# EAGLE schematic Layer1 (EAGLE 9.6.1)

## Sheet 1 of 5
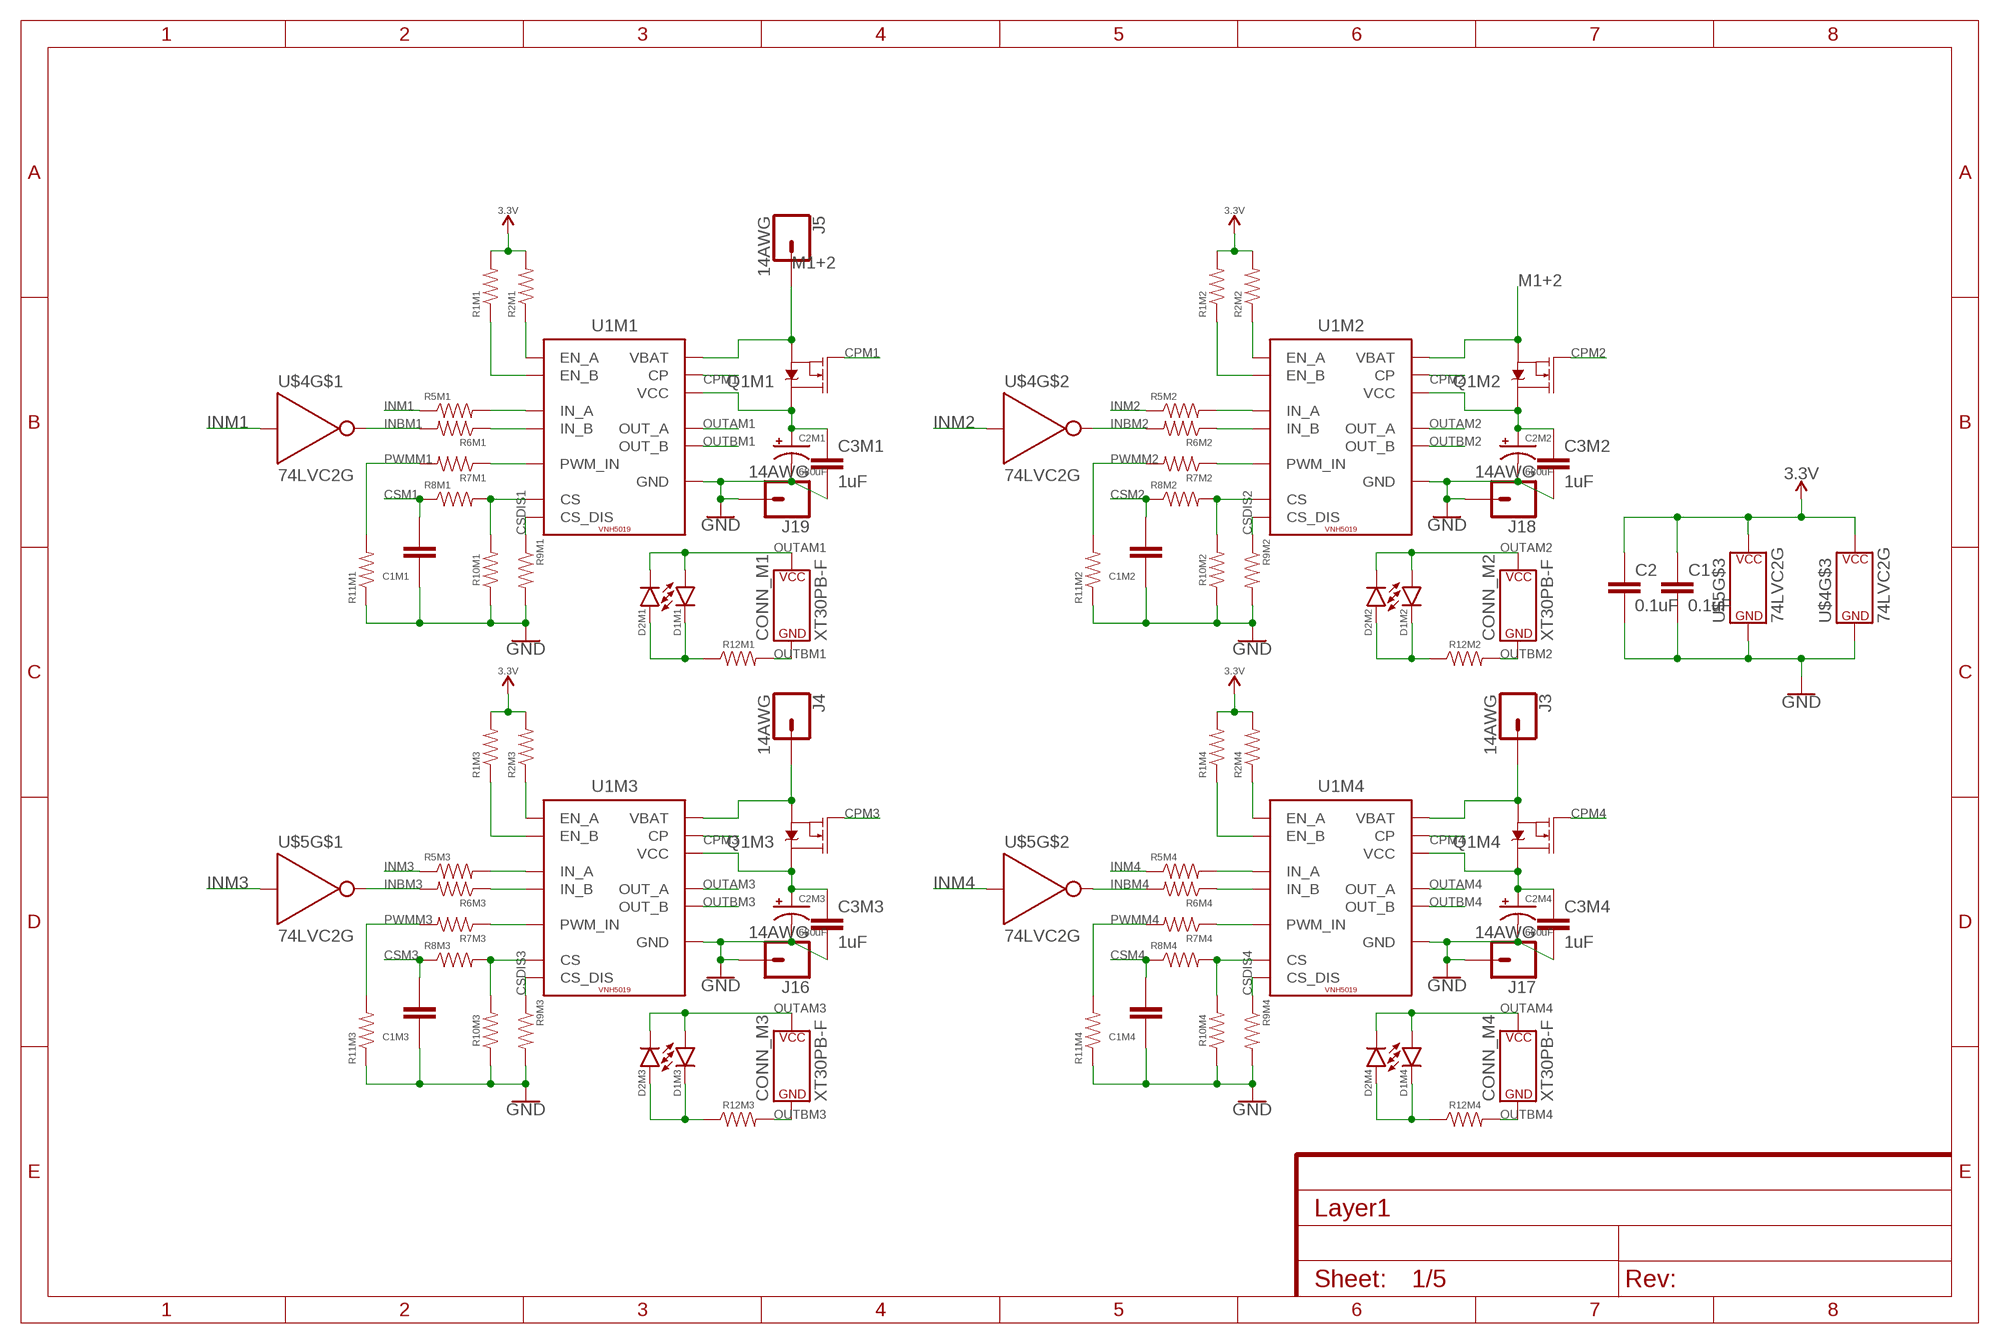
[diagram p0: schematic, sheet 1]

### Parts
C1  0.1uF  CAPACITOR0603  [C0603]
C1M1  33nF  CAPACITOR0603  [C0603]
C1M2  33nF  CAPACITOR0603  [C0603]
C1M3  33nF  CAPACITOR0603  [C0603]
C1M4  33nF  CAPACITOR0603  [C0603]
C2  0.1uF  CAPACITOR0603  [C0603]
C2M1  680uF  CPOL-USE3.5-8  [E3,5-8]
C2M2  680uF  CPOL-USE3.5-8  [E3,5-8]
C2M3  680uF  CPOL-USE3.5-8  [E3,5-8]
C2M4  680uF  CPOL-USE3.5-8  [E3,5-8]
C3M1  1uF  CAPACITOR0603  [C0603]
C3M2  1uF  CAPACITOR0603  [C0603]
C3M3  1uF  CAPACITOR0603  [C0603]
C3M4  1uF  CAPACITOR0603  [C0603]
CONN_M1  XT30PB-F  [XT30PB-F]
CONN_M2  XT30PB-F  [XT30PB-F]
CONN_M3  XT30PB-F  [XT30PB-F]
CONN_M4  XT30PB-F  [XT30PB-F]
D1M1  GREEN  LED0603  [LED-0603]
D1M2  GREEN  LED0603  [LED-0603]
D1M3  GREEN  LED0603  [LED-0603]
D1M4  GREEN  LED0603  [LED-0603]
D2M1  RED  LED0603  [LED-0603]
D2M2  RED  LED0603  [LED-0603]
D2M3  RED  LED0603  [LED-0603]
D2M4  RED  LED0603  [LED-0603]
J3  14AWG  [14AWG]
J4  14AWG  [14AWG]
J5  14AWG  [14AWG]
J16  14AWG  [14AWG]
J17  14AWG  [14AWG]
J18  14AWG  [14AWG]
J19  14AWG  [14AWG]
Q1M1  AOD482  MOSFET-NCH-DPAK  [DPAK]
Q1M2  AOD482  MOSFET-NCH-DPAK  [DPAK]
Q1M3  AOD482  MOSFET-NCH-DPAK  [DPAK]
Q1M4  AOD482  MOSFET-NCH-DPAK  [DPAK]
R1M1  3.24k  RESISTOR0603  [R0603]
R1M2  3.24k  RESISTOR0603  [R0603]
R1M3  3.24k  RESISTOR0603  [R0603]
R1M4  3.24k  RESISTOR0603  [R0603]
R2M1  3.24k  RESISTOR0603  [R0603]
R2M2  3.24k  RESISTOR0603  [R0603]
R2M3  3.24k  RESISTOR0603  [R0603]
R2M4  3.24k  RESISTOR0603  [R0603]
R5M1  1k  RESISTOR0603  [R0603]
R5M2  1k  RESISTOR0603  [R0603]
R5M3  1k  RESISTOR0603  [R0603]
R5M4  1k  RESISTOR0603  [R0603]
R6M1  1k  RESISTOR0603  [R0603]
R6M2  1k  RESISTOR0603  [R0603]
R6M3  1k  RESISTOR0603  [R0603]
R6M4  1k  RESISTOR0603  [R0603]
R7M1  1k  RESISTOR0603  [R0603]
R7M2  1k  RESISTOR0603  [R0603]
R7M3  1k  RESISTOR0603  [R0603]
R7M4  1k  RESISTOR0603  [R0603]
R8M1  10k  RESISTOR0603  [R0603]
R8M2  10k  RESISTOR0603  [R0603]
R8M3  10k  RESISTOR0603  [R0603]
R8M4  10k  RESISTOR0603  [R0603]
R9M1  10k  RESISTOR0603  [R0603]
R9M2  10k  RESISTOR0603  [R0603]
R9M3  10k  RESISTOR0603  [R0603]
R9M4  10k  RESISTOR0603  [R0603]
R10M1  1k  RESISTOR0603  [R0603]
R10M2  1k  RESISTOR0603  [R0603]
R10M3  1k  RESISTOR0603  [R0603]
R10M4  1k  RESISTOR0603  [R0603]
R11M1  10k  RESISTOR0603  [R0603]
R11M2  10k  RESISTOR0603  [R0603]
R11M3  10k  RESISTOR0603  [R0603]
R11M4  10k  RESISTOR0603  [R0603]
R12M1  4.7k  RESISTOR0603  [R0603]
R12M2  4.7k  RESISTOR0603  [R0603]
R12M3  4.7k  RESISTOR0603  [R0603]
R12M4  4.7k  RESISTOR0603  [R0603]
U1M1  VNH5019  [POWERSO-30]
U1M2  VNH5019  [POWERSO-30]
U1M3  VNH5019  [POWERSO-30]
U1M4  VNH5019  [POWERSO-30]
U$4  74LVC2G  [SOT23-6]
U$5  74LVC2G  [SOT23-6]

### Nets
3.3V: C1.1 C2.1 R1M1.2 R1M2.2 R1M3.2 R1M4.2 R2M1.2 R2M2.2 R2M3.2 R2M4.2 U$4.5(P$V+) U$5.5(P$V+) ; also sheet 3,4
CPM1: Q1M1.1(G) U1M1.P11(CP)
CPM2: Q1M2.1(G) U1M2.P11(CP)
CPM3: Q1M3.1(G) U1M3.P11(CP)
CPM4: Q1M4.1(G) U1M4.P11(CP)
CSDIS1: R9M1.1 U1M1.P6(CS_DIS)
CSDIS2: R9M2.1 U1M2.P6(CS_DIS)
CSDIS3: R9M3.1 U1M3.P6(CS_DIS)
CSDIS4: R9M4.1 U1M4.P6(CS_DIS)
CSM1: C1M1.2 R8M1.1 ; also sheet 2
CSM2: C1M2.2 R8M2.1 ; also sheet 2
CSM3: C1M3.2 R8M3.1 ; also sheet 2
CSM4: C1M4.2 R8M4.1 ; also sheet 2
GND: C1.2 C1M1.1 C1M2.1 C1M3.1 C1M4.1 C2.2 C2M1.- C2M2.- C2M3.- C2M4.- C3M1.2 C3M2.2 C3M3.2 C3M4.2 J16.P$1 J17.P$1 J18.P$1 J19.P$1 R9M1.2 R9M2.2 R9M3.2 R9M4.2 R10M1.1 R10M2.1 R10M3.1 R10M4.1 R11M1.1 R11M2.1 R11M3.1 R11M4.1 U1M1.P18(GND) U1M1.P19(GND) U1M1.P20(GND) U1M1.P26(GND) U1M1.P27(GND) U1M1.P28(GND) U1M2.P18(GND) U1M2.P19(GND) U1M2.P20(GND) U1M2.P26(GND) U1M2.P27(GND) U1M2.P28(GND) U1M3.P18(GND) U1M3.P19(GND) U1M3.P20(GND) U1M3.P26(GND) U1M3.P27(GND) U1M3.P28(GND) U1M4.P18(GND) U1M4.P19(GND) U1M4.P20(GND) U1M4.P26(GND) U1M4.P27(GND) U1M4.P28(GND) U$4.2(P$V-) U$5.2(P$V-) ; also sheet 2,3,4,5
INBM1: R6M1.2 U$4.6(Y)
INBM2: R6M2.2 U$4.4(Y)
INBM3: R6M3.2 U$5.6(Y)
INBM4: R6M4.2 U$5.4(Y)
INM1: R5M1.1 U$4.1(A) ; also sheet 4
INM2: R5M2.1 U$4.3(A) ; also sheet 4
INM3: R5M3.1 U$5.1(A) ; also sheet 4
INM4: R5M4.1 U$5.3(A) ; also sheet 4
M1+2: J5.P$1 Q1M1.3(S) Q1M2.3(S) U1M1.P12(VBAT) U1M2.P12(VBAT)
N$39: J3.P$1 Q1M4.3(S) U1M4.P12(VBAT)
N$40: J4.P$1 Q1M3.3(S) U1M3.P12(VBAT)
N$58: C2M1.+ C3M1.1 Q1M1.4(D) U1M1.P3(VCC) U1M1.P13(VCC) U1M1.P23(VCC) U1M1.P$19(VCC) U1M1.P$20(VCC) U1M1.P$21(VCC) U1M1.P$22(VCC) U1M1.P$23(VCC) U1M1.P$24(VCC) U1M1.P$25(VCC) U1M1.P$26(VCC) U1M1.P$27(VCC) U1M1.P$28(VCC) U1M1.SLUG1(VCC)
N$59: R2M1.1 U1M1.P5(EN_A)
N$60: R5M1.2 U1M1.P4(IN_A)
N$61: R1M1.1 U1M1.P9(EN_B)
N$62: R6M1.1 U1M1.P10(IN_B)
N$63: R8M1.2 R10M1.2 U1M1.P8(CS)
N$64: R7M1.1 U1M1.P7(PWM_IN)
N$65: D1M2.C D2M2.A R12M2.1
N$66: C2M2.+ C3M2.1 Q1M2.4(D) U1M2.P3(VCC) U1M2.P13(VCC) U1M2.P23(VCC) U1M2.P$19(VCC) U1M2.P$20(VCC) U1M2.P$21(VCC) U1M2.P$22(VCC) U1M2.P$23(VCC) U1M2.P$24(VCC) U1M2.P$25(VCC) U1M2.P$26(VCC) U1M2.P$27(VCC) U1M2.P$28(VCC) U1M2.SLUG1(VCC)
N$67: R2M2.1 U1M2.P5(EN_A)
N$68: R5M2.2 U1M2.P4(IN_A)
N$69: R1M2.1 U1M2.P9(EN_B)
N$70: R6M2.1 U1M2.P10(IN_B)
N$71: R8M2.2 R10M2.2 U1M2.P8(CS)
N$72: R7M2.1 U1M2.P7(PWM_IN)
N$73: D1M3.C D2M3.A R12M3.1
N$74: C2M3.+ C3M3.1 Q1M3.4(D) U1M3.P3(VCC) U1M3.P13(VCC) U1M3.P23(VCC) U1M3.P$19(VCC) U1M3.P$20(VCC) U1M3.P$21(VCC) U1M3.P$22(VCC) U1M3.P$23(VCC) U1M3.P$24(VCC) U1M3.P$25(VCC) U1M3.P$26(VCC) U1M3.P$27(VCC) U1M3.P$28(VCC) U1M3.SLUG1(VCC)
N$75: R2M3.1 U1M3.P5(EN_A)
N$76: R5M3.2 U1M3.P4(IN_A)
N$77: R1M3.1 U1M3.P9(EN_B)
N$78: R6M3.1 U1M3.P10(IN_B)
N$79: R8M3.2 R10M3.2 U1M3.P8(CS)
N$80: R7M3.1 U1M3.P7(PWM_IN)
N$81: D1M4.C D2M4.A R12M4.1
N$82: C2M4.+ C3M4.1 Q1M4.4(D) U1M4.P3(VCC) U1M4.P13(VCC) U1M4.P23(VCC) U1M4.P$19(VCC) U1M4.P$20(VCC) U1M4.P$21(VCC) U1M4.P$22(VCC) U1M4.P$23(VCC) U1M4.P$24(VCC) U1M4.P$25(VCC) U1M4.P$26(VCC) U1M4.P$27(VCC) U1M4.P$28(VCC) U1M4.SLUG1(VCC)
N$83: R2M4.1 U1M4.P5(EN_A)
N$84: R5M4.2 U1M4.P4(IN_A)
N$85: R1M4.1 U1M4.P9(EN_B)
N$86: R6M4.1 U1M4.P10(IN_B)
N$87: R8M4.2 R10M4.2 U1M4.P8(CS)
N$88: R7M4.1 U1M4.P7(PWM_IN)
N$104: D1M1.C D2M1.A R12M1.1
OUTAM1: CONN_M1.+(P$V+) D1M1.A D2M1.C U1M1.P1(OUT_A) U1M1.P25(OUT_A) U1M1.P30(OUT_A) U1M1.P$1(OUT_A) U1M1.P$2(OUT_A) U1M1.P$3(OUT_A) U1M1.P$4(OUT_A) U1M1.P$5(OUT_A) U1M1.P$6(OUT_A) U1M1.P$7(OUT_A) U1M1.P$8(OUT_A) U1M1.P$9(OUT_A) U1M1.SLUG2(OUT_A)
OUTAM2: CONN_M2.+(P$V+) D1M2.A D2M2.C U1M2.P1(OUT_A) U1M2.P25(OUT_A) U1M2.P30(OUT_A) U1M2.P$1(OUT_A) U1M2.P$2(OUT_A) U1M2.P$3(OUT_A) U1M2.P$4(OUT_A) U1M2.P$5(OUT_A) U1M2.P$6(OUT_A) U1M2.P$7(OUT_A) U1M2.P$8(OUT_A) U1M2.P$9(OUT_A) U1M2.SLUG2(OUT_A)
OUTAM3: CONN_M3.+(P$V+) D1M3.A D2M3.C U1M3.P1(OUT_A) U1M3.P25(OUT_A) U1M3.P30(OUT_A) U1M3.P$1(OUT_A) U1M3.P$2(OUT_A) U1M3.P$3(OUT_A) U1M3.P$4(OUT_A) U1M3.P$5(OUT_A) U1M3.P$6(OUT_A) U1M3.P$7(OUT_A) U1M3.P$8(OUT_A) U1M3.P$9(OUT_A) U1M3.SLUG2(OUT_A)
OUTAM4: CONN_M4.+(P$V+) D1M4.A D2M4.C U1M4.P1(OUT_A) U1M4.P25(OUT_A) U1M4.P30(OUT_A) U1M4.P$1(OUT_A) U1M4.P$2(OUT_A) U1M4.P$3(OUT_A) U1M4.P$4(OUT_A) U1M4.P$5(OUT_A) U1M4.P$6(OUT_A) U1M4.P$7(OUT_A) U1M4.P$8(OUT_A) U1M4.P$9(OUT_A) U1M4.SLUG2(OUT_A)
OUTBM1: CONN_M1.-(P$V-) R12M1.2 U1M1.P15(OUT_B) U1M1.P16(OUT_B) U1M1.P21(OUT_B) U1M1.P$10(OUT_B) U1M1.P$11(OUT_B) U1M1.P$12(OUT_B) U1M1.P$13(OUT_B) U1M1.P$14(OUT_B) U1M1.P$15(OUT_B) U1M1.P$16(OUT_B) U1M1.P$17(OUT_B) U1M1.P$18(OUT_B) U1M1.SLUG3(OUT_B)
OUTBM2: CONN_M2.-(P$V-) R12M2.2 U1M2.P15(OUT_B) U1M2.P16(OUT_B) U1M2.P21(OUT_B) U1M2.P$10(OUT_B) U1M2.P$11(OUT_B) U1M2.P$12(OUT_B) U1M2.P$13(OUT_B) U1M2.P$14(OUT_B) U1M2.P$15(OUT_B) U1M2.P$16(OUT_B) U1M2.P$17(OUT_B) U1M2.P$18(OUT_B) U1M2.SLUG3(OUT_B)
OUTBM3: CONN_M3.-(P$V-) R12M3.2 U1M3.P15(OUT_B) U1M3.P16(OUT_B) U1M3.P21(OUT_B) U1M3.P$10(OUT_B) U1M3.P$11(OUT_B) U1M3.P$12(OUT_B) U1M3.P$13(OUT_B) U1M3.P$14(OUT_B) U1M3.P$15(OUT_B) U1M3.P$16(OUT_B) U1M3.P$17(OUT_B) U1M3.P$18(OUT_B) U1M3.SLUG3(OUT_B)
OUTBM4: CONN_M4.-(P$V-) R12M4.2 U1M4.P15(OUT_B) U1M4.P16(OUT_B) U1M4.P21(OUT_B) U1M4.P$10(OUT_B) U1M4.P$11(OUT_B) U1M4.P$12(OUT_B) U1M4.P$13(OUT_B) U1M4.P$14(OUT_B) U1M4.P$15(OUT_B) U1M4.P$16(OUT_B) U1M4.P$17(OUT_B) U1M4.P$18(OUT_B) U1M4.SLUG3(OUT_B)
PWMM1: R7M1.2 R11M1.2 ; also sheet 4
PWMM2: R7M2.2 R11M2.2 ; also sheet 4
PWMM3: R7M3.2 R11M3.2 ; also sheet 4
PWMM4: R7M4.2 R11M4.2 ; also sheet 4
Unconnected: U1M1.P2(NC) U1M1.P14(NC) U1M1.P17(NC) U1M1.P22(NC) U1M1.P24(NC) U1M1.P29(NC) U1M2.P2(NC) U1M2.P14(NC) U1M2.P17(NC) U1M2.P22(NC) U1M2.P24(NC) U1M2.P29(NC) U1M3.P2(NC) U1M3.P14(NC) U1M3.P17(NC) U1M3.P22(NC) U1M3.P24(NC) U1M3.P29(NC) U1M4.P2(NC) U1M4.P14(NC) U1M4.P17(NC) U1M4.P22(NC) U1M4.P24(NC) U1M4.P29(NC)

## Sheet 2 of 5
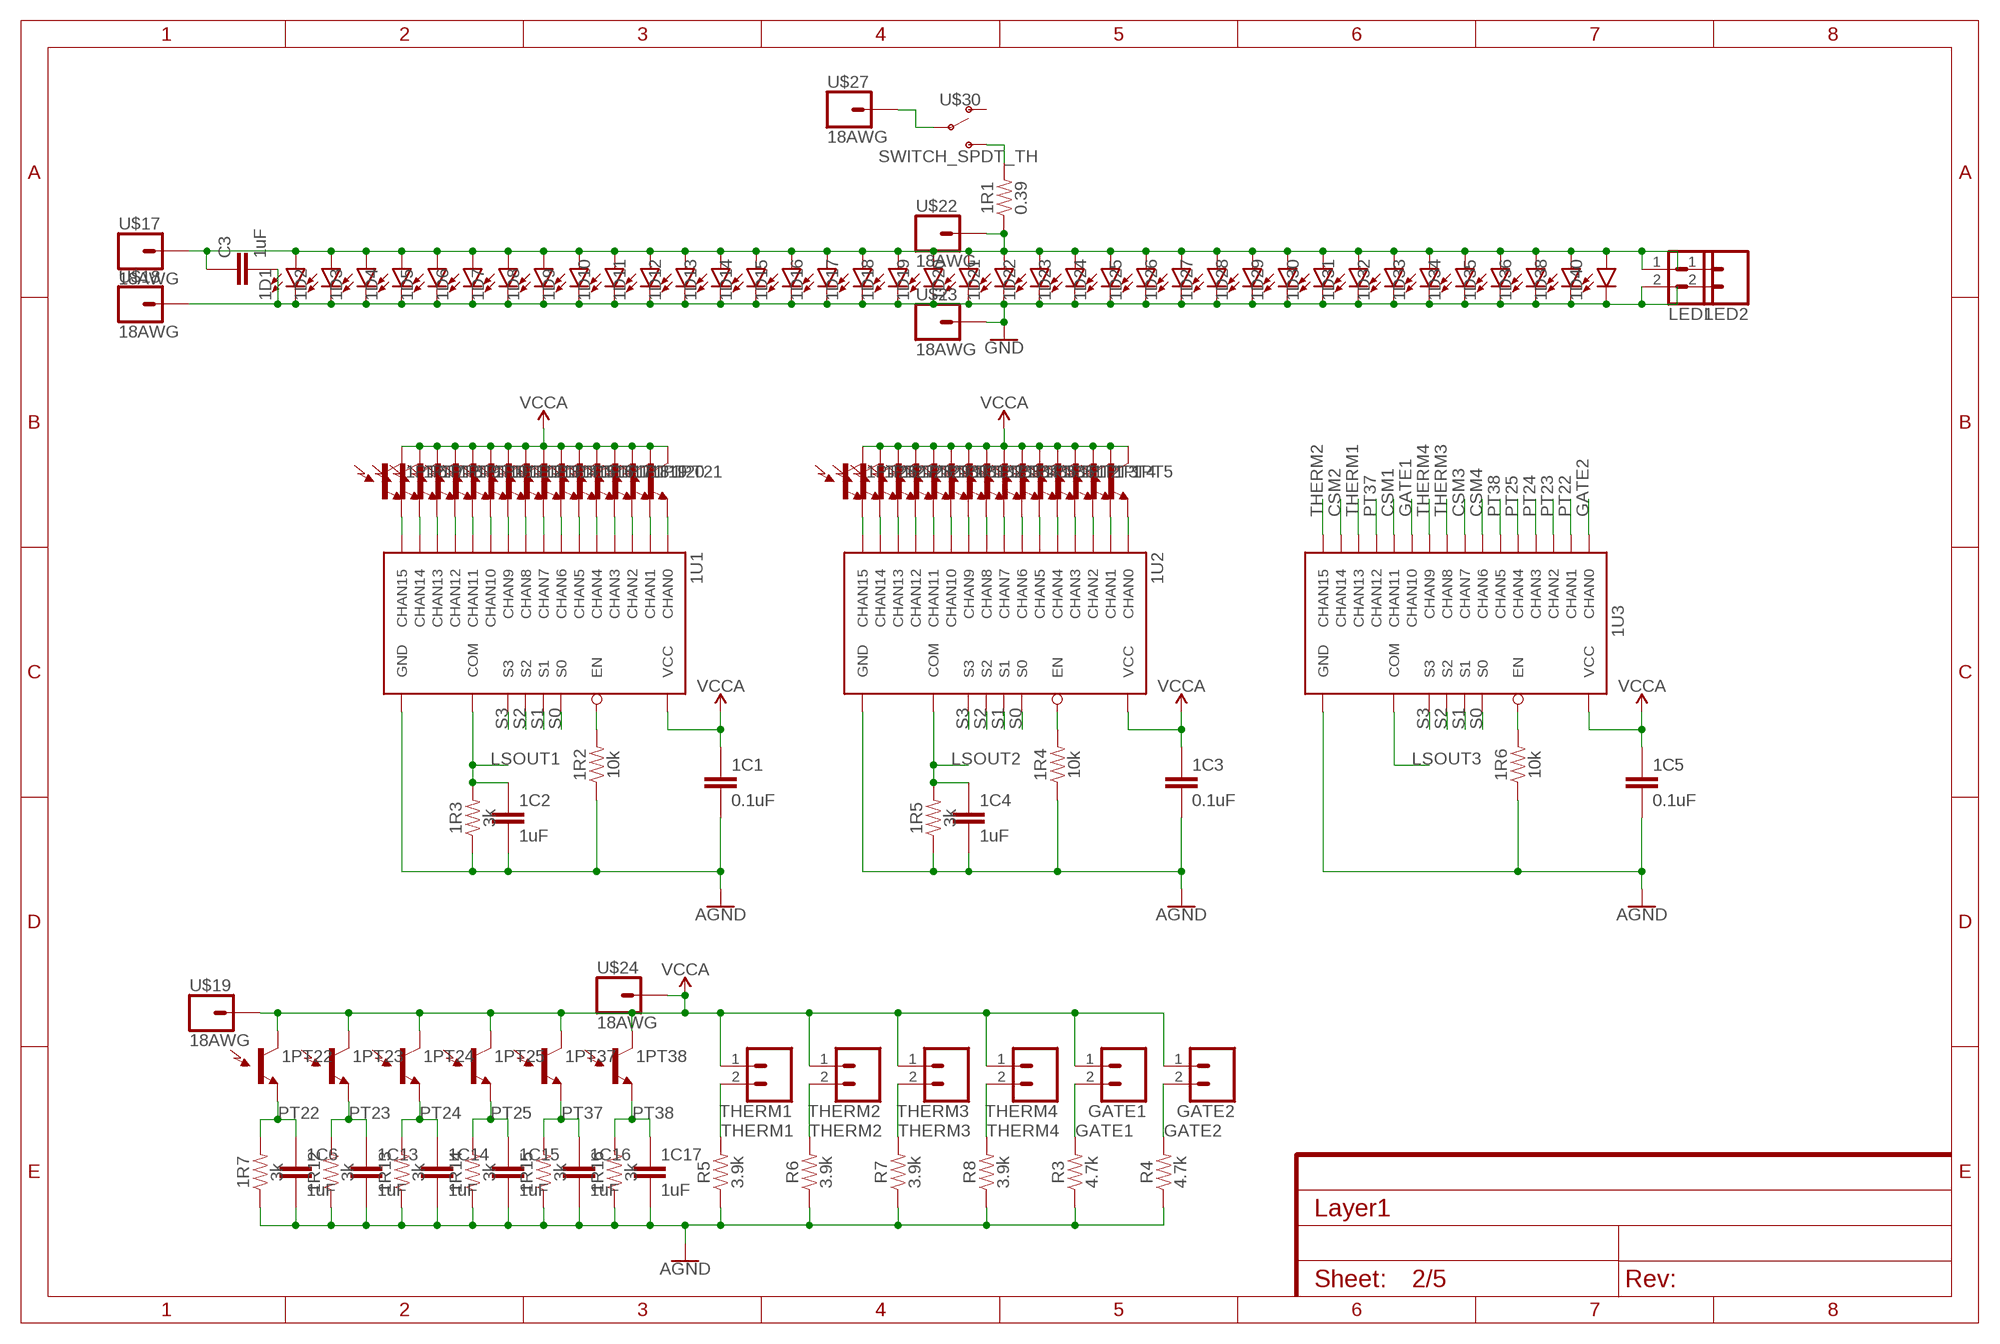
[diagram p1: schematic, sheet 2]

### Parts
1C1  0.1uF  CAPACITOR0603  [C0603]
1C2  1uF  CAPACITOR0603  [C0603]
1C3  0.1uF  CAPACITOR0603  [C0603]
1C4  1uF  CAPACITOR0603  [C0603]
1C5  0.1uF  CAPACITOR0603  [C0603]
1C6  1uF  CAPACITOR0603  [C0603]
1C13  1uF  CAPACITOR0603  [C0603]
1C14  1uF  CAPACITOR0603  [C0603]
1C15  1uF  CAPACITOR0603  [C0603]
1C16  1uF  CAPACITOR0603  [C0603]
1C17  1uF  CAPACITOR0603  [C0603]
1D1  3528LED  [3528]
1D2  3528LED  [3528]
1D3  3528LED  [3528]
1D4  3528LED  [3528]
1D5  3528LED  [3528]
1D6  3528LED  [3528]
1D7  3528LED  [3528]
1D8  3528LED  [3528]
1D9  3528LED  [3528]
1D10  3528LED  [3528]
1D11  3528LED  [3528]
1D12  3528LED  [3528]
1D13  3528LED  [3528]
1D14  3528LED  [3528]
1D15  3528LED  [3528]
1D16  3528LED  [3528]
1D17  3528LED  [3528]
1D18  3528LED  [3528]
1D19  3528LED  [3528]
1D20  3528LED  [3528]
1D21  3528LED  [3528]
1D22  3528LED  [3528]
1D23  3528LED  [3528]
1D24  3528LED  [3528]
1D25  3528LED  [3528]
1D26  3528LED  [3528]
1D27  3528LED  [3528]
1D28  3528LED  [3528]
1D29  3528LED  [3528]
1D30  3528LED  [3528]
1D31  3528LED  [3528]
1D32  3528LED  [3528]
1D33  3528LED  [3528]
1D34  3528LED  [3528]
1D35  3528LED  [3528]
1D36  3528LED  [3528]
1D38  3528LED  [3528]
1D40  3528LED  [3528]
1PT1  LIGHT_SENSOR_ALS  [ALS-PT19]
1PT2  LIGHT_SENSOR_ALS  [ALS-PT19]
1PT3  LIGHT_SENSOR_ALS  [ALS-PT19]
1PT4  LIGHT_SENSOR_ALS  [ALS-PT19]
1PT5  LIGHT_SENSOR_ALS  [ALS-PT19]
1PT6  LIGHT_SENSOR_ALS  [ALS-PT19]
1PT7  LIGHT_SENSOR_ALS  [ALS-PT19]
1PT8  LIGHT_SENSOR_ALS  [ALS-PT19]
1PT9  LIGHT_SENSOR_ALS  [ALS-PT19]
1PT10  LIGHT_SENSOR_ALS  [ALS-PT19]
1PT11  LIGHT_SENSOR_ALS  [ALS-PT19]
1PT12  LIGHT_SENSOR_ALS  [ALS-PT19]
1PT13  LIGHT_SENSOR_ALS  [ALS-PT19]
1PT14  LIGHT_SENSOR_ALS  [ALS-PT19]
1PT15  LIGHT_SENSOR_ALS  [ALS-PT19]
1PT16  LIGHT_SENSOR_ALS  [ALS-PT19]
1PT17  LIGHT_SENSOR_ALS  [ALS-PT19]
1PT18  LIGHT_SENSOR_ALS  [ALS-PT19]
1PT19  LIGHT_SENSOR_ALS  [ALS-PT19]
1PT20  LIGHT_SENSOR_ALS  [ALS-PT19]
1PT21  LIGHT_SENSOR_ALS  [ALS-PT19]
1PT22  LIGHT_SENSOR_ALS  [ALS-PT19]
1PT23  LIGHT_SENSOR_ALS  [ALS-PT19]
1PT24  LIGHT_SENSOR_ALS  [ALS-PT19]
1PT25  LIGHT_SENSOR_ALS  [ALS-PT19]
1PT26  LIGHT_SENSOR_ALS  [ALS-PT19]
1PT27  LIGHT_SENSOR_ALS  [ALS-PT19]
1PT28  LIGHT_SENSOR_ALS  [ALS-PT19]
1PT29  LIGHT_SENSOR_ALS  [ALS-PT19]
1PT30  LIGHT_SENSOR_ALS  [ALS-PT19]
1PT31  LIGHT_SENSOR_ALS  [ALS-PT19]
1PT32  LIGHT_SENSOR_ALS  [ALS-PT19]
1PT33  LIGHT_SENSOR_ALS  [ALS-PT19]
1PT34  LIGHT_SENSOR_ALS  [ALS-PT19]
1PT35  LIGHT_SENSOR_ALS  [ALS-PT19]
1PT36  LIGHT_SENSOR_ALS  [ALS-PT19]
1PT37  LIGHT_SENSOR_ALS  [ALS-PT19]
1PT38  LIGHT_SENSOR_ALS  [ALS-PT19]
1R1  0.39  RESISTOR0603  [R0603]
1R2  10k  RESISTOR0603  [R0603]
1R3  3k  RESISTOR0603  [R0603]
1R4  10k  RESISTOR0603  [R0603]
1R5  3k  RESISTOR0603  [R0603]
1R6  10k  RESISTOR0603  [R0603]
1R7  3k  RESISTOR0603  [R0603]
1R12  3k  RESISTOR0603  [R0603]
1R13  3k  RESISTOR0603  [R0603]
1R14  3k  RESISTOR0603  [R0603]
1R15  3k  RESISTOR0603  [R0603]
1R16  3k  RESISTOR0603  [R0603]
1U1  CD74HC4067SSOP-24  [SSOP24]
1U2  CD74HC4067SSOP-24  [SSOP24]
1U3  CD74HC4067SSOP-24  [SSOP24]
C3  1uF  CAPACITOR0603  [C0603]
GATE1  CONN_021X02_NO_SILK  [1X02_NO_SILK]
GATE2  CONN_021X02_NO_SILK  [1X02_NO_SILK]
LED1  CONN_021X02_NO_SILK  [1X02_NO_SILK]
LED2  CONN_021X02_NO_SILK  [1X02_NO_SILK]
R3  4.7k  RESISTOR0603  [R0603]
R4  4.7k  RESISTOR0603  [R0603]
R5  3.9k  RESISTOR0603  [R0603]
R6  3.9k  RESISTOR0603  [R0603]
R7  3.9k  RESISTOR0603  [R0603]
R8  3.9k  RESISTOR0603  [R0603]
THERM1  CONN_021X02_NO_SILK  [1X02_NO_SILK]
THERM2  CONN_021X02_NO_SILK  [1X02_NO_SILK]
THERM3  CONN_021X02_NO_SILK  [1X02_NO_SILK]
THERM4  CONN_021X02_NO_SILK  [1X02_NO_SILK]
U$17  18AWG  [18AWG]
U$18  18AWG  [18AWG]
U$19  18AWG  [18AWG]
U$22  18AWG  [18AWG]
U$23  18AWG  [18AWG]
U$24  18AWG  [18AWG]
U$27  18AWG  [18AWG]
U$30  SWITCH_SPDT_TH  [SWITCH_SPDT_PTH_11.6X4.0MM_LOCK]

### Nets
AGND: 1C1.2 1C2.2 1C3.2 1C4.2 1C5.2 1C6.2 1C13.2 1C14.2 1C15.2 1C16.2 1C17.2 1R2.1 1R3.1 1R4.1 1R5.1 1R6.1 1R7.1 1R12.1 1R13.1 1R14.1 1R15.1 1R16.1 1U1.12(GND) 1U2.12(GND) 1U3.12(GND) R3.1 R4.1 R5.1 R6.1 R7.1 R8.1 ; also sheet 4
CSM1: 1U3.20(CHAN11) ; also sheet 1
CSM2: 1U3.17(CHAN14) ; also sheet 1
CSM3: 1U3.2(CHAN7) ; also sheet 1
CSM4: 1U3.3(CHAN6) ; also sheet 1
GATE1: 1U3.21(CHAN10) GATE1.2 R3.2
GATE2: 1U3.9(CHAN0) GATE2.2 R4.2
GND: 1D1.C 1D2.C 1D3.C 1D4.C 1D5.C 1D6.C 1D7.C 1D8.C 1D9.C 1D10.C 1D11.C 1D12.C 1D13.C 1D14.C 1D15.C 1D16.C 1D17.C 1D18.C 1D19.C 1D20.C 1D21.C 1D22.C 1D23.C 1D24.C 1D25.C 1D26.C 1D27.C 1D28.C 1D29.C 1D30.C 1D31.C 1D32.C 1D33.C 1D34.C 1D35.C 1D36.C 1D38.C 1D40.C C3.2 LED1.2 LED2.2 U$18.P$1 U$23.P$1 ; also sheet 1,3,4,5
LSOUT1: 1C2.1 1R3.2 1U1.1(COM) ; also sheet 4
LSOUT2: 1C4.1 1R5.2 1U2.1(COM) ; also sheet 4
LSOUT3: 1U3.1(COM) ; also sheet 4
N$1: 1D1.A 1D2.A 1D3.A 1D4.A 1D5.A 1D6.A 1D7.A 1D8.A 1D9.A 1D10.A 1D11.A 1D12.A 1D13.A 1D14.A 1D15.A 1D16.A 1D17.A 1D18.A 1D19.A 1D20.A 1D21.A 1D22.A 1D23.A 1D24.A 1D25.A 1D26.A 1D27.A 1D28.A 1D29.A 1D30.A 1D31.A 1D32.A 1D33.A 1D34.A 1D35.A 1D36.A 1D38.A 1D40.A 1R1.1 C3.1 LED1.1 LED2.1 U$17.P$1 U$22.P$1
N$2: 1PT26.E(E1) 1U2.16(CHAN15)
N$3: 1R1.2 U$30.3(S)
N$4: 1PT27.E(E1) 1U2.17(CHAN14)
N$5: 1PT28.E(E1) 1U2.18(CHAN13)
N$6: 1PT29.E(E1) 1U2.19(CHAN12)
N$7: 1PT30.E(E1) 1U2.20(CHAN11)
N$8: 1PT31.E(E1) 1U2.21(CHAN10)
N$9: 1PT32.E(E1) 1U2.22(CHAN9)
N$10: 1PT33.E(E1) 1U2.23(CHAN8)
N$11: 1PT34.E(E1) 1U2.2(CHAN7)
N$12: 1PT35.E(E1) 1U2.3(CHAN6)
N$13: 1PT36.E(E1) 1U2.4(CHAN5)
N$14: 1PT1.E(E1) 1U2.5(CHAN4)
N$15: 1PT2.E(E1) 1U2.6(CHAN3)
N$16: 1PT3.E(E1) 1U2.7(CHAN2)
N$17: 1PT4.E(E1) 1U2.8(CHAN1)
N$18: 1PT5.E(E1) 1U2.9(CHAN0)
N$19: 1PT6.E(E1) 1U1.16(CHAN15)
N$20: 1R2.2 1U1.15(EN)
N$21: 1PT7.E(E1) 1U1.17(CHAN14)
N$22: 1PT8.E(E1) 1U1.18(CHAN13)
N$23: 1PT9.E(E1) 1U1.19(CHAN12)
N$24: 1PT10.E(E1) 1U1.20(CHAN11)
N$25: 1PT11.E(E1) 1U1.21(CHAN10)
N$26: 1PT12.E(E1) 1U1.22(CHAN9)
N$27: 1PT13.E(E1) 1U1.23(CHAN8)
N$28: 1PT14.E(E1) 1U1.2(CHAN7)
N$29: 1PT15.E(E1) 1U1.3(CHAN6)
N$30: 1PT16.E(E1) 1U1.4(CHAN5)
N$31: 1PT17.E(E1) 1U1.5(CHAN4)
N$32: 1PT18.E(E1) 1U1.6(CHAN3)
N$33: 1PT19.E(E1) 1U1.7(CHAN2)
N$34: 1PT20.E(E1) 1U1.8(CHAN1)
N$35: 1PT21.E(E1) 1U1.9(CHAN0)
N$36: U$27.P$1 U$30.2(P)
N$38: 1R4.2 1U2.15(EN)
N$56: 1R6.2 1U3.15(EN)
PT22: 1C6.1 1PT22.E(E1) 1R7.2 1U3.8(CHAN1)
PT23: 1C13.1 1PT23.E(E1) 1R12.2 1U3.7(CHAN2)
PT24: 1C14.1 1PT24.E(E1) 1R13.2 1U3.6(CHAN3)
PT25: 1C15.1 1PT25.E(E1) 1R14.2 1U3.5(CHAN4)
PT37: 1C16.1 1PT37.E(E1) 1R15.2 1U3.19(CHAN12)
PT38: 1C17.1 1PT38.E(E1) 1R16.2 1U3.4(CHAN5)
S0: 1U1.10(S0) 1U2.10(S0) 1U3.10(S0) ; also sheet 4
S1: 1U1.11(S1) 1U2.11(S1) 1U3.11(S1) ; also sheet 4
S2: 1U1.14(S2) 1U2.14(S2) 1U3.14(S2) ; also sheet 4
S3: 1U1.13(S3) 1U2.13(S3) 1U3.13(S3) ; also sheet 4
THERM1: 1U3.18(CHAN13) R5.2 THERM1.2
THERM2: 1U3.16(CHAN15) R6.2 THERM2.2
THERM3: 1U3.23(CHAN8) R7.2 THERM3.2
THERM4: 1U3.22(CHAN9) R8.2 THERM4.2
VCCA: 1C1.1 1C3.1 1C5.1 1PT1.C(C1) 1PT2.C(C1) 1PT3.C(C1) 1PT4.C(C1) 1PT5.C(C1) 1PT6.C(C1) 1PT7.C(C1) 1PT8.C(C1) 1PT9.C(C1) 1PT10.C(C1) 1PT11.C(C1) 1PT12.C(C1) 1PT13.C(C1) 1PT14.C(C1) 1PT15.C(C1) 1PT16.C(C1) 1PT17.C(C1) 1PT18.C(C1) 1PT19.C(C1) 1PT20.C(C1) 1PT21.C(C1) 1PT22.C(C1) 1PT23.C(C1) 1PT24.C(C1) 1PT25.C(C1) 1PT26.C(C1) 1PT27.C(C1) 1PT28.C(C1) 1PT29.C(C1) 1PT30.C(C1) 1PT31.C(C1) 1PT32.C(C1) 1PT33.C(C1) 1PT34.C(C1) 1PT35.C(C1) 1PT36.C(C1) 1PT37.C(C1) 1PT38.C(C1) 1U1.24(VCC) 1U2.24(VCC) 1U3.24(VCC) GATE1.1 GATE2.1 THERM1.1 THERM2.1 THERM3.1 THERM4.1 U$19.P$1 U$24.P$1 ; also sheet 4
Unconnected: U$30.1(O)

## Sheet 3 of 5
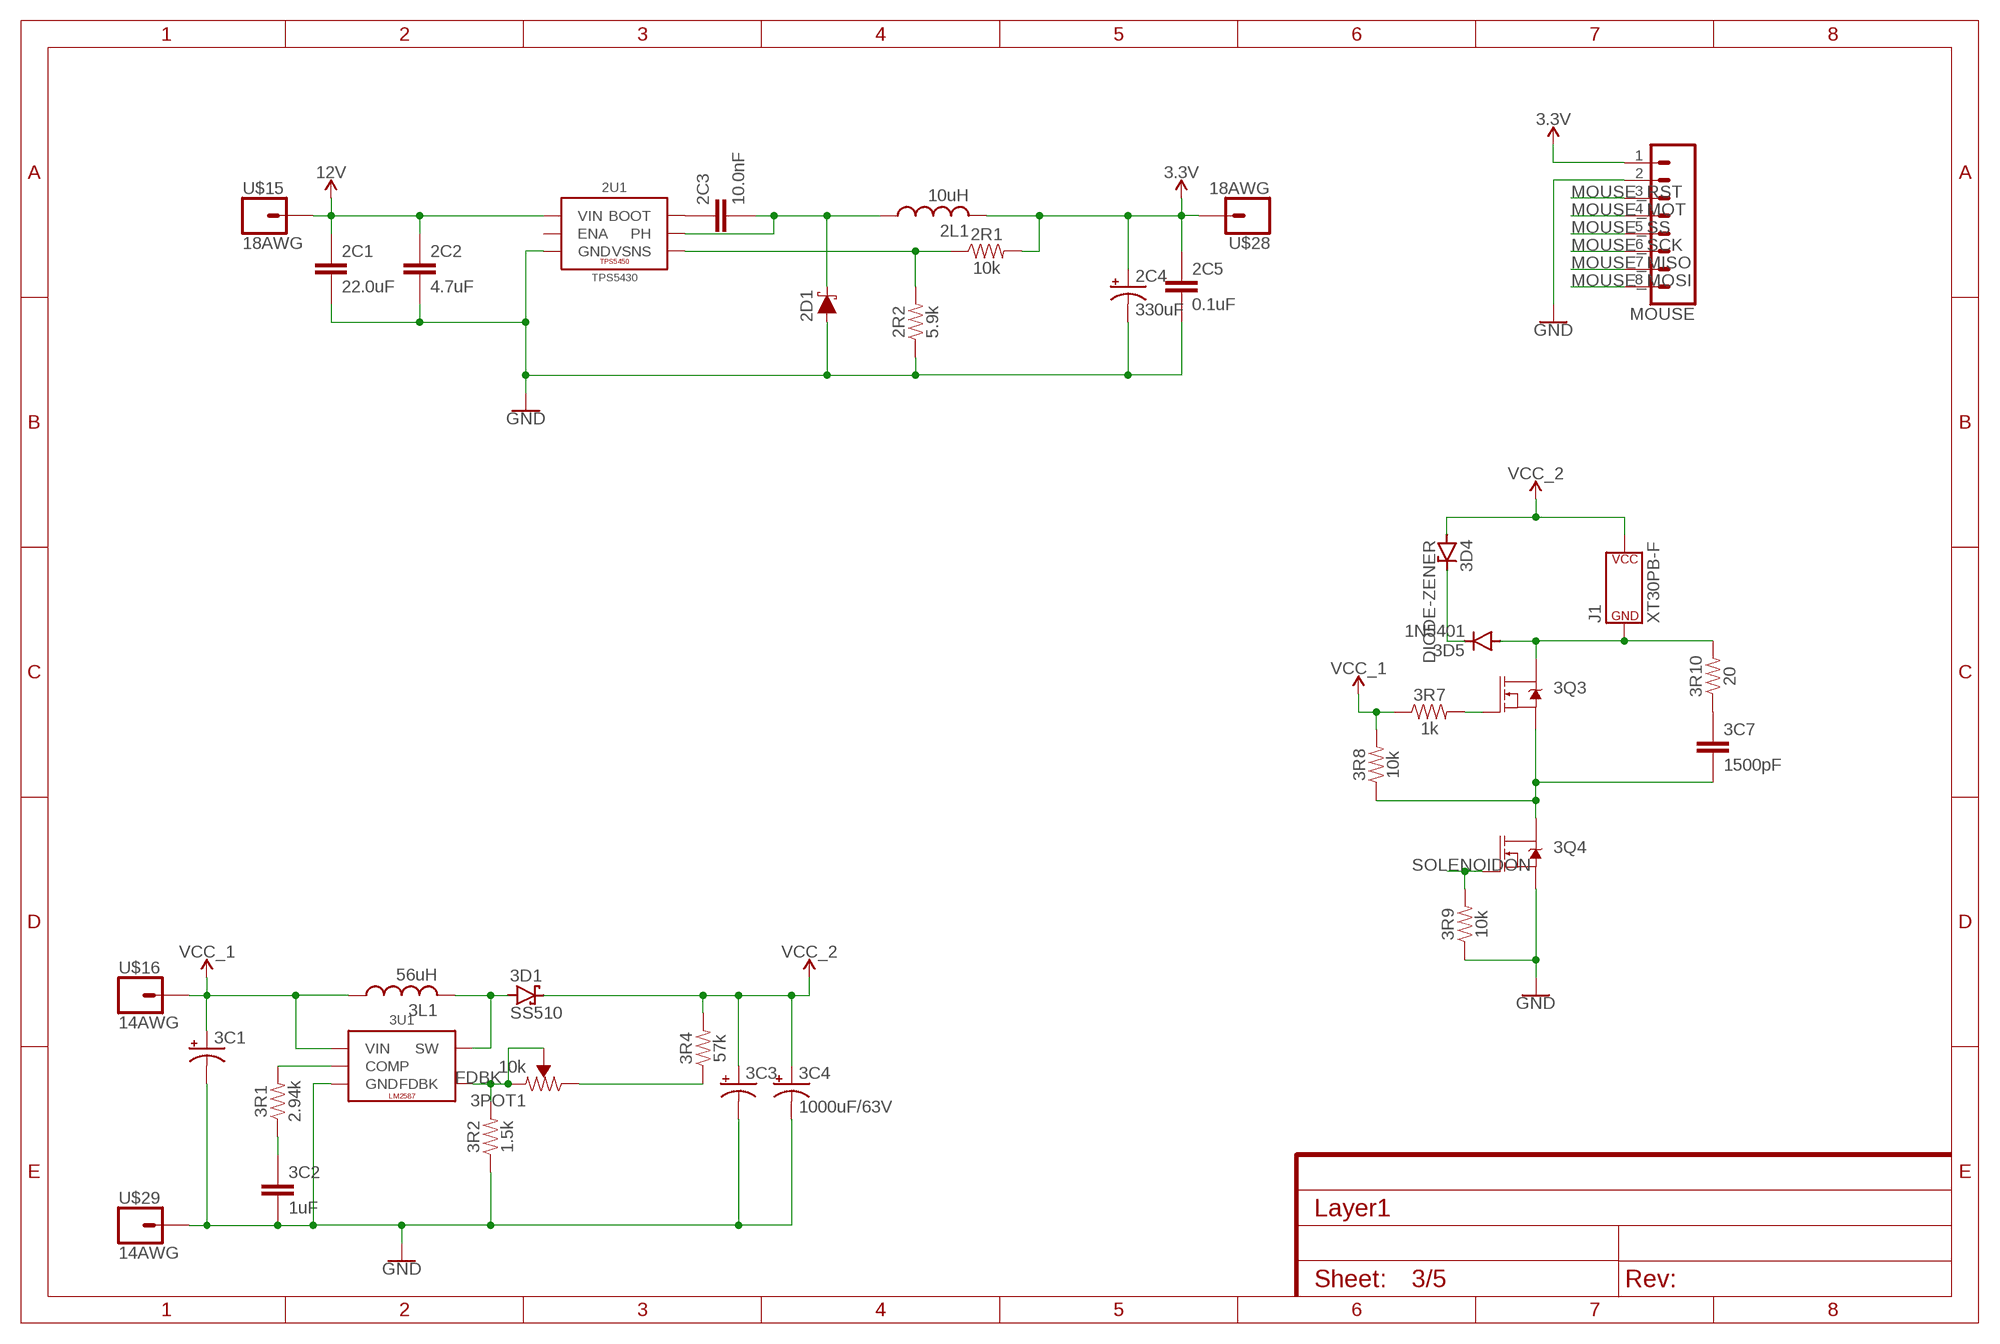
[diagram p2: schematic, sheet 3]

### Parts
2C1  22.0uF  CAPACITOR1210  [C1210]
2C2  4.7uF  CAPACITOR0603  [C0603]
2C3  10.0nF  CAPACITOR0603  [C0603]
2C4  330uF  CPOL-USD/7343-31R  [D/7343-31R]
2C5  0.1uF  CAPACITOR0603  [C0603]
2D1  SS54  DIODE-SCHOTTKY  [SMA-DIODE]
2L1  10uH  INDUCTORSWPA8040  [SWPA8040]
2R1  10k  RESISTOR0603  [R0603]
2R2  5.9k  RESISTOR0603  [R0603]
2U1  TPS5430  TPS5450  [POWERPAD-SOIC-8]
3C1  100uF  CPOL-USD  [PANASONIC_D]
3C2  1uF  CAPACITOR0603  [C0603]
3C3  CAPACITOR_POL_10X10.5MM  [10X10.5_CAP]
3C4  1000uF/63V  1000UF-CAP  [1000UF-CAP]
3C7  1500pF  CAPACITOR0603  [C0603]
3D1  SS510  SCHOTTKY-DIODESMD  [SMB]
3D4  DIODE-ZENER  [DO41Z10]
3D5  1N5401  1N5400  [DO201-15]
3L1  56uH  INDUCTORCDRH127  [CDRH127]
3POT1  10k  3296-TRIMPOT  [3296-TRIMPOT]
3Q3  STP75NF75  MOSFET-NCH-TO220V  [TO220V]
3Q4  AO3400  MOSFET-NCH-SOT23-3  [SOT23-3]
3R1  2.94k  RESISTOR0603  [R0603]
3R2  1.5k  RESISTOR0603  [R0603]
3R4  57k  RESISTOR0603  [R0603]
3R7  1k  RESISTOR0603  [R0603]
3R8  10k  RESISTOR0603  [R0603]
3R9  10k  RESISTOR0603  [R0603]
3R10  20  RESISTOR0603  [R0603]
3U1  LM2587  [TO-263]
J1  XT30PB-F  [XT30PB-F]
MOUSE  CONN_08LOCK  [1X08_LOCK]
U$15  18AWG  [18AWG]
U$16  14AWG  [14AWG]
U$28  18AWG  [18AWG]
U$29  14AWG  [14AWG]

### Nets
3.3V: 2C4.+ 2C5.1 2L1.P2 2R1.2 MOUSE.1 U$28.P$1 ; also sheet 1,4
12V: 2C1.1 2C2.1 2U1.7(VIN) U$15.P$1
FDBK: 3POT1.1(CCW) 3POT1.2(WIPER) 3R2.2 3U1.P2(FDBK)
GND: 2C1.2 2C2.2 2C4.- 2C5.2 2D1.A 2R2.1 2U1.6(GND) 2U1.9(GND) 2U1.P$1(GND) 2U1.P$2(GND) 2U1.P$3(GND) 2U1.P$4(GND) 2U1.P$5(GND) 2U1.P$6(GND) 3C1.- 3C2.2 3C3.- 3C4.- 3Q4.2(S) 3R2.1 3R9.1 3U1.P3(GND) 3U1.P$1(GND) 3U1.P$2(GND) 3U1.P$3(GND) 3U1.P$4(GND) 3U1.P$5(GND) 3U1.P$6(GND) 3U1.P$7(GND) 3U1.P$8(GND) 3U1.P$9(GND) 3U1.P$10(GND) 3U1.P$11(GND) 3U1.P$12(GND) 3U1.P$13(GND) 3U1.P$14(GND) 3U1.P$15(GND) 3U1.P$16(GND) 3U1.P$17(GND) 3U1.P$18(GND) 3U1.P$19(GND) 3U1.P$20(GND) 3U1.TAB(GND) MOUSE.2 U$29.P$1 ; also sheet 1,2,4,5
MOUSE_MISO: MOUSE.7 ; also sheet 4
MOUSE_MOSI: MOUSE.8 ; also sheet 4
MOUSE_MOT: MOUSE.4 ; also sheet 4
MOUSE_RST: MOUSE.3 ; also sheet 4
MOUSE_SCK: MOUSE.6 ; also sheet 4
MOUSE_SS: MOUSE.5 ; also sheet 4
N$37: 3POT1.3(CW) 3R4.1
N$90: 3D1.A 3L1.2 3U1.P4(SW)
N$91: 3R1.2 3U1.P1(COMP)
N$92: 3C2.1 3R1.1
N$95: 3C7.2 3Q3.3(S) 3Q4.3(D) 3R8.1
N$96: 3Q3.1(G) 3R7.2
N$97: 3D4.C 3D5.C
N$101: 2C3.2 2D1.C 2L1.P1 2U1.8(PH)
N$102: 2R1.1 2R2.2 2U1.4(VSNS)
N$103: 2C3.1 2U1.1(BOOT)
N$105: 3C7.1 3R10.1
SOLENOIDGND: 3D5.A 3Q3.2(D) 3R10.2 J1.-(P$V-)
SOLENOIDON: 3Q4.1(G) 3R9.2 ; also sheet 4
VCC_1: 3C1.+ 3L1.1 3R7.1 3R8.2 3U1.P5(VIN) U$16.P$1
VCC_2: 3C3.+ 3C4.+ 3D1.C 3D4.A 3R4.2 J1.+(P$V+)
Unconnected: 2U1.2(NC) 2U1.3(NC) 2U1.5(ENA)

## Sheet 4 of 5
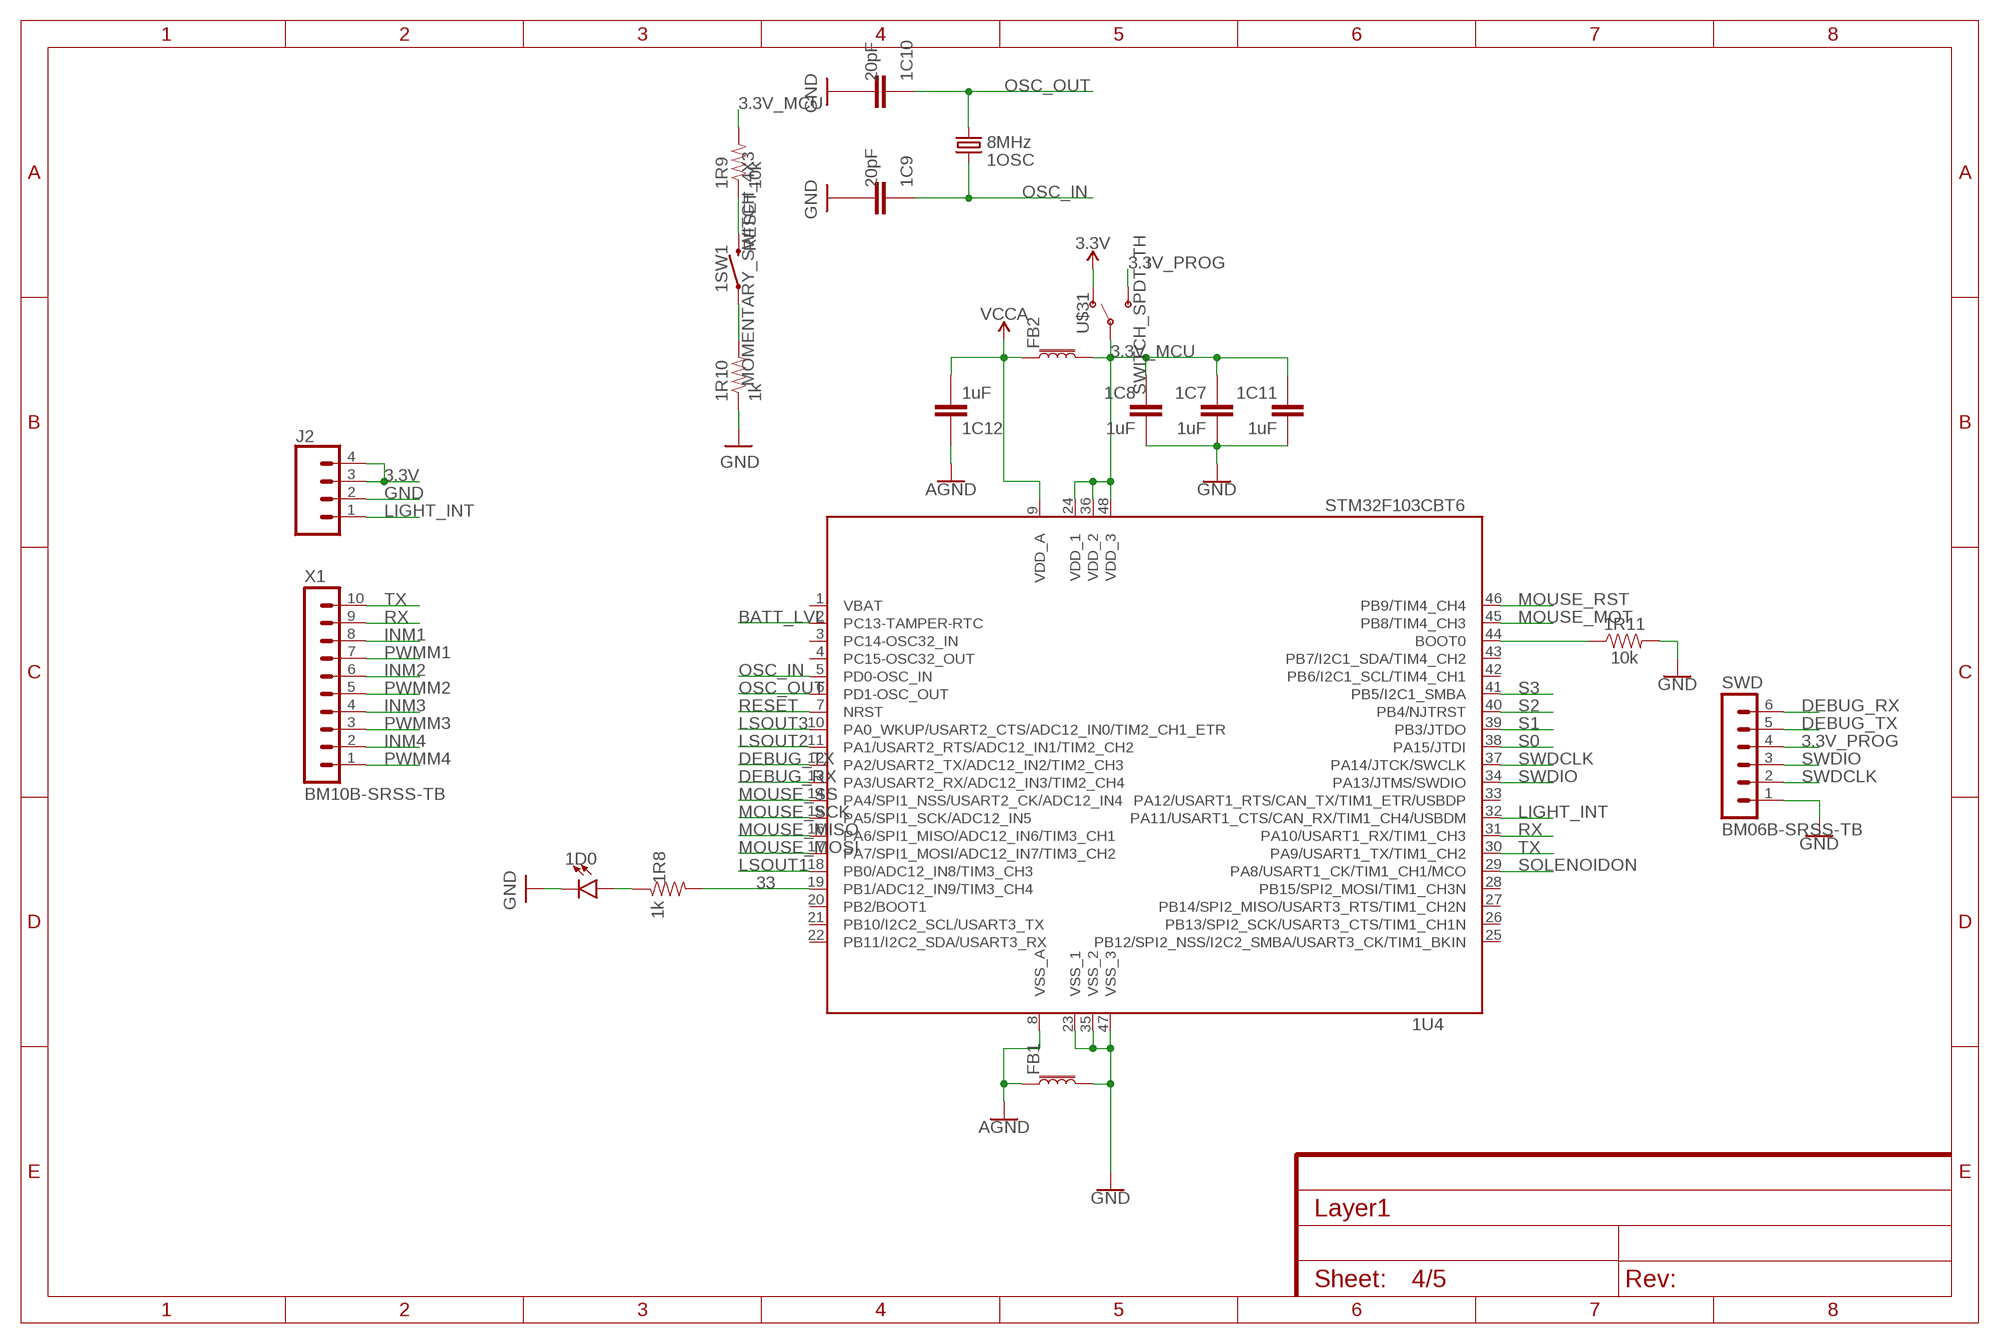
[diagram p3: schematic, sheet 4]

### Parts
1C7  1uF  CAPACITOR0603  [C0603]
1C8  1uF  CAPACITOR0603  [C0603]
1C9  20pF  CAPACITOR0603  [C0603]
1C10  20pF  CAPACITOR0603  [C0603]
1C11  1uF  CAPACITOR0603  [C0603]
1C12  1uF  CAPACITOR0603  [C0603]
1D0  BLUE  LED0603  [LED-0603]
1OSC  8MHz  CRYSTAL_5032  [CRYSTAL-SMD-5X3.2-2PAD]
1R8  1k  RESISTOR0603  [R0603]
1R9  10k  RESISTOR0603  [R0603]
1R10  1k  RESISTOR0603  [R0603]
1R11  10k  RESISTOR0603  [R0603]
1SW1  MOMENTARY_SWITCH_4X3  [MOMENTARY_SWITCH_4X3]
1U4  STM32F103CBT6  [LQFP48]
FB1  FERRITE_BEAD  [R0603]
FB2  FERRITE_BEAD  [R0603]
J2  CONN_04LOCK  [1X04_LOCK]
SWD  BM06B-SRSS-TB  [BM06B-SRSS-TB]
U$31  SWITCH_SPDT_TH  [SWITCH_SPDT_PTH_11.6X4.0MM_LOCK]
X1  BM10B-SRSS-TB  [BM10B-SRSS-TB]

### Nets
3.3V: J2.3 J2.4 U$31.1(O) ; also sheet 1,3
3.3V_MCU: 1C7.1 1C8.1 1C11.1 1R9.2 1U4.24(VDD_1) 1U4.36(VDD_2) 1U4.48(VDD_3) FB2.2 U$31.2(P)
3.3V_PROG: SWD.4 U$31.3(S)
33: 1R8.2 1U4.19(PB1/ADC12_IN9/TIM3_CH4)
AGND: 1C12.1 1U4.8(VSS_A) FB1.1 ; also sheet 2
BATT_LVL: 1U4.2(PC13-TAMPER-RTC) ; also sheet 5
DEBUG_RX: 1U4.13(PA3/USART2_RX/ADC12_IN3/TIM2_CH4) SWD.6
DEBUG_TX: 1U4.12(PA2/USART2_TX/ADC12_IN2/TIM2_CH3) SWD.5
GND: 1C7.2 1C8.2 1C9.2 1C10.2 1C11.2 1D0.C 1R10.1 1R11.2 1U4.23(VSS_1) 1U4.35(VSS_2) 1U4.47(VSS_3) FB1.2 J2.2 SWD.1 ; also sheet 1,2,3,5
INM1: X1.8 ; also sheet 1
INM2: X1.6 ; also sheet 1
INM3: X1.4 ; also sheet 1
INM4: X1.2 ; also sheet 1
LIGHT_INT: 1U4.32(PA11/USART1_CTS/CAN_RX/TIM1_CH4/USBDM) J2.1
LSOUT1: 1U4.18(PB0/ADC12_IN8/TIM3_CH3) ; also sheet 2
LSOUT2: 1U4.11(PA1/USART2_RTS/ADC12_IN1/TIM2_CH2) ; also sheet 2
LSOUT3: 1U4.10(PA0_WKUP/USART2_CTS/ADC12_IN0/TIM2_CH1_ETR) ; also sheet 2
MOUSE_MISO: 1U4.16(PA6/SPI1_MISO/ADC12_IN6/TIM3_CH1) ; also sheet 3
MOUSE_MOSI: 1U4.17(PA7/SPI1_MOSI/ADC12_IN7/TIM3_CH2) ; also sheet 3
MOUSE_MOT: 1U4.45(PB8/TIM4_CH3) ; also sheet 3
MOUSE_RST: 1U4.46(PB9/TIM4_CH4) ; also sheet 3
MOUSE_SCK: 1U4.15(PA5/SPI1_SCK/ADC12_IN5) ; also sheet 3
MOUSE_SS: 1U4.14(PA4/SPI1_NSS/USART2_CK/ADC12_IN4) ; also sheet 3
N$98: 1R10.2 1SW1.P$1
N$99: 1D0.A 1R8.1
N$100: 1R11.1 1U4.44(BOOT0)
OSC_IN: 1C9.1 1OSC.P$2 1U4.5(PD0-OSC_IN)
OSC_OUT: 1C10.1 1OSC.P$1 1U4.6(PD1-OSC_OUT)
PWMM1: X1.7 ; also sheet 1
PWMM2: X1.5 ; also sheet 1
PWMM3: X1.3 ; also sheet 1
PWMM4: X1.1 ; also sheet 1
RESET: 1R9.1 1SW1.P$2 1U4.7(NRST)
RX: 1U4.31(PA10/USART1_RX/TIM1_CH3) X1.9
S0: 1U4.38(PA15/JTDI) ; also sheet 2
S1: 1U4.39(PB3/JTDO) ; also sheet 2
S2: 1U4.40(PB4/NJTRST) ; also sheet 2
S3: 1U4.41(PB5/I2C1_SMBA) ; also sheet 2
SOLENOIDON: 1U4.29(PA8/USART1_CK/TIM1_CH1/MCO) ; also sheet 3
SWDCLK: 1U4.37(PA14/JTCK/SWCLK) SWD.2
SWDIO: 1U4.34(PA13/JTMS/SWDIO) SWD.3
TX: 1U4.30(PA9/USART1_TX/TIM1_CH2) X1.10
VCCA: 1C12.2 1U4.9(VDD_A) FB2.1 ; also sheet 2
Unconnected: 1U4.3(PC14-OSC32_IN) 1U4.4(PC15-OSC32_OUT) 1U4.20(PB2/BOOT1) 1U4.21(PB10/I2C2_SCL/USART3_TX) 1U4.22(PB11/I2C2_SDA/USART3_RX) 1U4.25(PB12/SPI2_NSS/I2C2_SMBA/USART3_CK/TIM1_BKIN) 1U4.26(PB13/SPI2_SCK/USART3_CTS/TIM1_CH1N) 1U4.27(PB14/SPI2_MISO/USART3_RTS/TIM1_CH2N) 1U4.28(PB15/SPI2_MOSI/TIM1_CH3N) 1U4.33(PA12/USART1_RTS/CAN_TX/TIM1_ETR/USBDP) 1U4.42(PB6/I2C1_SCL/TIM4_CH1) 1U4.43(PB7/I2C1_SDA/TIM4_CH2)

## Sheet 5 of 5
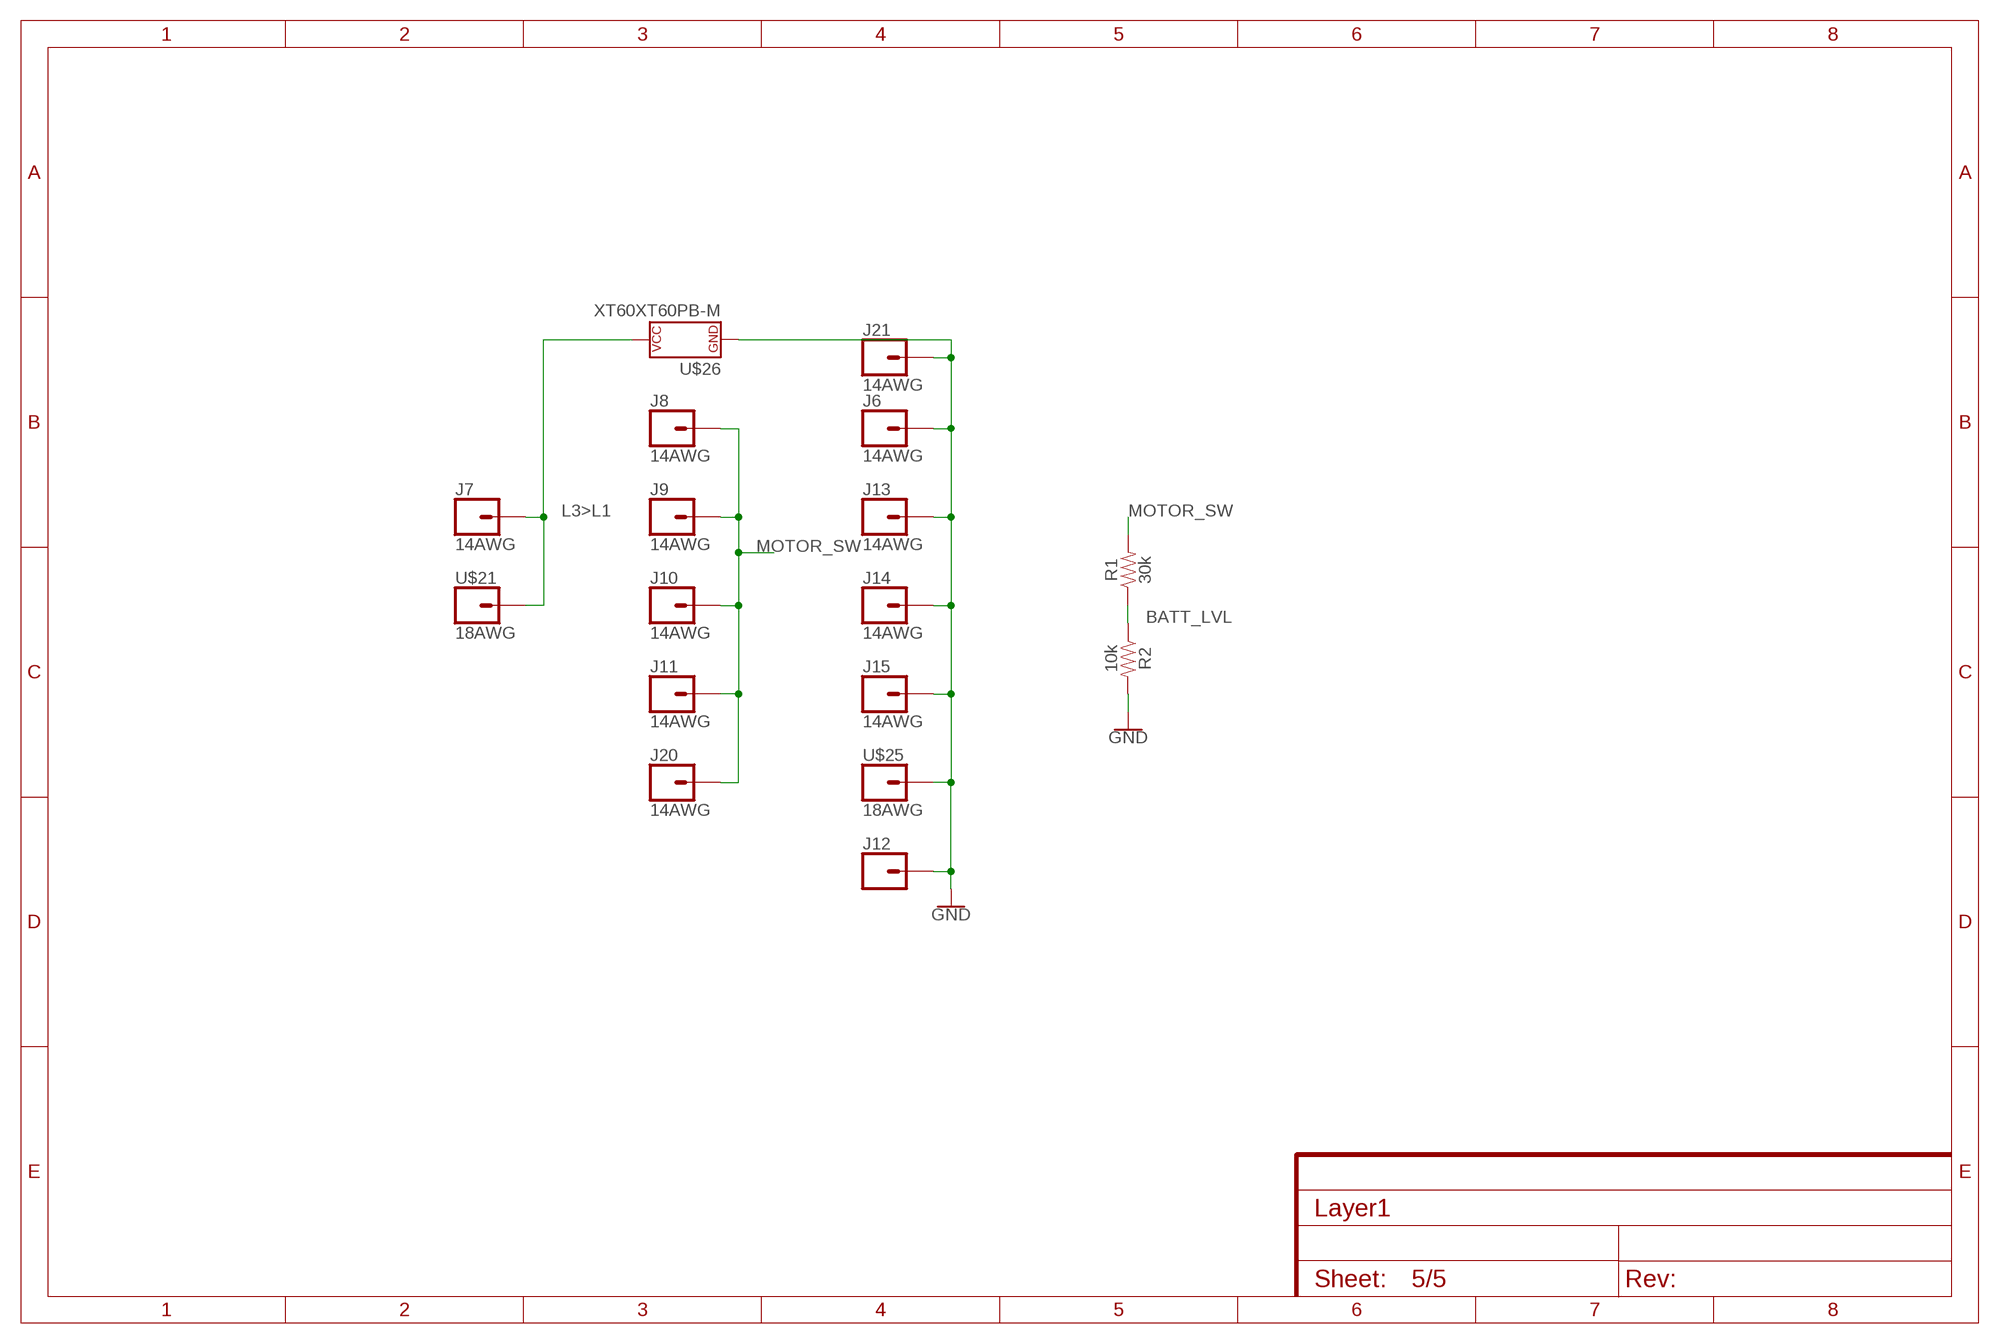
[diagram p4: schematic, sheet 5]

### Parts
J6  14AWG  [14AWG]
J7  14AWG  [14AWG]
J8  14AWG  [14AWG]
J9  14AWG  [14AWG]
J10  14AWG  [14AWG]
J11  14AWG  [14AWG]
J12  CONN_01  [1X01]
J13  14AWG  [14AWG]
J14  14AWG  [14AWG]
J15  14AWG  [14AWG]
J20  14AWG  [14AWG]
J21  14AWG  [14AWG]
R1  30k  RESISTOR0603  [R0603]
R2  10k  RESISTOR0603  [R0603]
U$21  18AWG  [18AWG]
U$25  18AWG  [18AWG]
U$26  XT60XT60PB-M  [XT60PB-M]

### Nets
BATT_LVL: R1.1 R2.1 ; also sheet 4
GND: J6.P$1 J12.1 J13.P$1 J14.P$1 J15.P$1 J21.P$1 R2.2 U$25.P$1 U$26.-(P$V-) ; also sheet 1,2,3,4
L3>L1: J7.P$1 U$21.P$1 U$26.+(P$V+)
MOTOR_SW: J8.P$1 J9.P$1 J10.P$1 J11.P$1 J20.P$1 R1.2

## Power pins joined to a net without a drawn wire
VBAT: 1U4.1(VBAT)

## Library data of the parts
1C1-1C17 2C1-2C3 2C5 3C2 3C7 C1 C1M1-C1M4 C2 C3 C3M1-C3M4 = JH:CAPACITOR
1D0 D1M1-D1M4 D2M1-D2M4 = JH:LED: Blue SMD LED Used in manufacturing of various products at SparkFun Packages: 0603 - SMD 0603 package [Product Link] <http://www.digikey.com/product-detail/en/SMLE12BC7TT86/511-1589-2-ND/1641808> 1206 - SMD1206 package [Product Link] <http://www.digikey.com/product-detail/en/lite-on-inc/LTST-C150TBKT/160-1643-1-ND/573584> SparkFun Products: ESP8266 Thing-Dev Board <https://www.sparkfun.com/products/13711> RedBoard <https://www.sparkfun.com/products/12757>
1D1-1D36 1D38 1D40 = JH:3528LED
1OSC = JH:CRYSTAL: Crystals (Generic) These are passive quartz crystals, which can be used as a clock source for a microcontroller. Crystal's are two-terminal devices. They require external "load" capacitors to generate an oscillating signal.
1PT1-1PT38 = JH:LIGHT_SENSOR: Ambient Light Sensors - Phototransistors Low cost ambient light sensors, consisting of a phototransistor in miniature SMD packages. Output voltage varies with light intensity. SparkFun Products ALS-PT19 Light Sensor <https://www.sparkfun.com/products/12566> (SEN-12566) Ambient Light Sensor - TEMT6000 <https://www.sparkfun.com/products/8348> (SEN-08348) SparkFun Ambient Light Sensor Breakout - TEMT60000 <https://www.sparkfun.com/products/8688> (SEN-08688)
1R1-1R16 2R1 2R2 3R1 3R2 3R4 3R7-3R10 R1 R1M1-R1M4 R2 R2M1-R2M4 R3-R5 R5M1-R5M4 R6 R6M1-R6M4 R7 R7M1-R7M4 R8 R8M1-R8M4 R9M1-R9M4 R10M1-R10M4 R11M1-R11M4 R12M1-R12M4 = JH:RESISTOR
1SW1 = JH:MOMENTARY_SWITCH_4X3
1U1-1U3 = JH:CD74HC4067
1U4 = JH:STM32F103CBT6
2C4 3C1 C2M1-C2M4 = rcl:CPOL-US: POLARIZED CAPACITOR, American symbol; SPICEPREFIX: C
2D1 = JH:DIODE-SCHOTTKY
2L1 3L1 = JH:INDUCTOR
2U1 = JH:TPS5450
3C3 = JH:CAPACITOR_POL
3C4 = JH:1000UF-CAP
3D1 = diode:SCHOTTKY-DIODE: Schottky Diode
3D4 = JH:DIODE-ZENER: Z DIODE 1 W
3D5 = diode:1N5400: DIODE standard rectifier, 3 A, 50 V (Motorola)
3POT1 = JH:3296-TRIMPOT
3Q3 3Q4 Q1M1-Q1M4 = JH:MOSFET-NCH: N-channel MOSFETs Voltage controlled devices that allow control of high current outputs. SparkFun Products: SparkFun OpenScale <https://www.sparkfun.com/products/13261> SparkFun Digital Sandbox <https://www.sparkfun.com/products/12651> SparkFun Monster Moto Shield <https://www.sparkfun.com/products/10182> SparkFun MOSFET Power Controller <https://www.sparkfun.com/products/11214>
3U1 = JH:LM2587
CONN_M1-CONN_M4 J1 = JH:XT30
FB1 FB2 = JH:FERRITE_BEAD: Ferrite Bead (blocks, cores, rings, chokes, etc.) Inductor with layers of ferrite used to suppress high frequencies. Often used to isolate high frequency noise. SparkFun Products: IOIO-OTG - V2.2 <https://www.sparkfun.com/products/13613> SparkFun SAMD21 Mini Breakout <https://www.sparkfun.com/products/13664> SparkFun 6 Degrees of Freedom Breakout - LSM6DS3 <https://www.sparkfun.com/products/13339> SparkFun SAMD21 Dev Breakout <https://www.sparkfun.com/products/13672>
GATE1 GATE2 LED1 LED2 THERM1-THERM4 = SparkFun-Connectors:CONN_02: Multi connection point. Often used as Generic Header-pin footprint for 0.1 inch spaced/style header connections On any of the 0.1 inch spaced packages, you can populate with these: Break Away Headers - Straight <https://www.sparkfun.com/products/116> (PRT-00116) Break Away Male Headers - Right Angle <https://www.sparkfun.com/products/553> (PRT-00553) Female Headers <https://www.sparkfun.com/products/115> (PRT-00115) Break Away Headers - Machine Pin <https://www.sparkfun.com/products/117> (PRT-00117) Break Away Female Headers - Swiss Machine Pin <https://www.sparkfun.com/products/743> (PRT-00743) For SCREWTERMINALS and SPRING TERMINALS visit here: Screw Terimnals on SparkFun.com <https://www.sparkfun.com/search/results?term=Screw+Terminals> (5mm/3.5mm/2.54mm spacing) This device is also useful as a general connection point to wire up your design to another part of your project. Our various solder wires solder well into these plated through hole pads. Hook-Up Wire - Assortment (Stranded, 22 AWG) <https://www.sparkfun.com/products/11375> (PRT-11375) Hook-Up Wire - Assortment (Solid Core, 22 AWG) <https://www.sparkfun.com/products/11367> (PRT-11367) View the entire wire category on our website here <https://www.sparkfun.com/categories/141> Special notes: Molex polarized connector foot print use with: PRT-08233 with associated crimp pins and housings. 2.54_SCREWTERM for use with PRT-10571. 3.5mm Screw Terminal footprints for PRT-08084 5mm Screw Terminal footprints for use with PRT-08432
J2 = Connectors:CONN_04: Multi connection point. Often used as Generic Header-pin footprint for 0.1 inch spaced/style header connections On any of the 0.1 inch spaced packages, you can populate with these: Break Away Headers - Straight <https://www.sparkfun.com/products/116> (PRT-00116) Break Away Male Headers - Right Angle <https://www.sparkfun.com/products/553> (PRT-00553) Female Headers <https://www.sparkfun.com/products/115> (PRT-00115) Break Away Headers - Machine Pin <https://www.sparkfun.com/products/117> (PRT-00117) Break Away Female Headers - Swiss Machine Pin <https://www.sparkfun.com/products/743> (PRT-00743) For SCREWTERMINALS and SPRING TERMINALS visit here: Screw Terimnals on SparkFun.com <https://www.sparkfun.com/search/results?term=Screw+Terminals> (5mm/3.5mm/2.54mm spacing) This device is also useful as a general connection point to wire up your design to another part of your project. Our various solder wires solder well into these plated through hole pads. Hook-Up Wire - Assortment (Stranded, 22 AWG) <https://www.sparkfun.com/products/11375> (PRT-11375) Hook-Up Wire - Assortment (Solid Core, 22 AWG) <https://www.sparkfun.com/products/11367> (PRT-11367) View the entire wire category on our website here <https://www.sparkfun.com/categories/141> Special notes: Molex polarized connector foot print use with SKU : PRT-08231 with associated crimp pins and housings. 1MM SMD Version SKU: PRT-10208; PROD_ID: CONN-09696
J3-J11 J13-J21 U$16 U$29 = JH:14AWG
J12 = SparkFun-Connectors:CONN_01: Single connection point. Often used as Generic Header-pin footprint for 0.1 inch spaced/style header connections On any of the 0.1 inch spaced packages, you can populate with these: Break Away Headers - Straight <https://www.sparkfun.com/products/116> (PRT-00116) Break Away Male Headers - Right Angle <https://www.sparkfun.com/products/553> (PRT-00553) Female Headers <https://www.sparkfun.com/products/115> (PRT-00115) Break Away Headers - Machine Pin <https://www.sparkfun.com/products/117> (PRT-00117) Break Away Female Headers - Swiss Machine Pin <https://www.sparkfun.com/products/743> (PRT-00743) This device is also useful as a general connection point to wire up your design to another part of your project. Our various solder wires solder well into these plated through hole pads. Hook-Up Wire - Assortment (Stranded, 22 AWG) <https://www.sparkfun.com/products/11375> (PRT-11375) Hook-Up Wire - Assortment (Solid Core, 22 AWG) <https://www.sparkfun.com/products/11367> (PRT-11367) View the entire wire category on our website here <https://www.sparkfun.com/categories/141> Special notes: SMTSO-256-ET is a "flush mount" nut for a 4-40 screw. We mostly use this on specialty testbeds; it is a nice way to connect hardware to your PCB at an adjustable hieght. Also note, the SNAP packages are for using a snappable style connector. We sell a baggie of snaps and they are also used on two LilyPad designs: Snap Assortment - 30 pack (male and female) <https://www.sparkfun.com/products/11347> (DEV-11347) LilyPad Arduino SimpleSnap <https://www.sparkfun.com/products/10941> (DEV-10941) LilyPad SimpleSnap Protoboard <https://www.sparkfun.com/products/10940> (DEV-10940)
MOUSE = Connectors:CONN_08: Multi connection point. Often used as Generic Header-pin footprint for 0.1 inch spaced/style header connections On any of the 0.1 inch spaced packages, you can populate with these: Break Away Headers - Straight <https://www.sparkfun.com/products/116> (PRT-00116) Break Away Male Headers - Right Angle <https://www.sparkfun.com/products/553> (PRT-00553) Female Headers <https://www.sparkfun.com/products/115> (PRT-00115) Break Away Headers - Machine Pin <https://www.sparkfun.com/products/117> (PRT-00117) Break Away Female Headers - Swiss Machine Pin <https://www.sparkfun.com/products/743> (PRT-00743) Arduino Stackable Header - 8 Pin <https://www.sparkfun.com/products/9279> (PRT-09279) For SCREWTERMINALS and SPRING TERMINALS visit here: Screw Terimnals on SparkFun.com <https://www.sparkfun.com/search/results?term=Screw+Terminals> (5mm/3.5mm/2.54mm spacing) This device is also useful as a general connection point to wire up your design to another part of your project. Our various solder wires solder well into these plated through hole pads. Hook-Up Wire - Assortment (Stranded, 22 AWG) <https://www.sparkfun.com/products/11375> (PRT-11375) Hook-Up Wire - Assortment (Solid Core, 22 AWG) <https://www.sparkfun.com/products/11367> (PRT-11367) View the entire wire category on our website here <https://www.sparkfun.com/categories/141> Special notes: Molex polarized connector foot print use with SKU : PRT-08231 with associated crimp pins and housings. 1MM SMD Version SKU: PRT-10208 NOTES ON THE VARIANTS LOCK and LOCK_LONGPADS... This footprint was designed to help hold the alignment of a through-hole component (i.e. 6-pin header) while soldering it into place. You may notice that each hole has been shifted either up or down by 0.005 of an inch from it's more standard position (which is a perfectly straight line). This slight alteration caused the pins (the squares in the middle) to touch the edges of the holes. Because they are alternating, it causes a "brace" to hold the component in place. 0.005 has proven to be the perfect amount of "off-center" position when using our standard breakaway headers. Although looks a little odd when you look at the bare footprint, once you have a header in there, the alteration is very hard to notice. Also,if you push a header all the way into place, it is covered up entirely on the bottom side.
SWD = con-JST SH:BM06B-SRSS: JST SH series header 1.00mm pitch disconnectable crimp style connectors, vertical (side entry type), 6 pins
U1M1-U1M4 = JH:VNH5019
U$4 U$5 = JH:74LVC2G
U$15 U$17-U$19 U$21-U$25 U$27 U$28 = JH:18AWG
U$26 = JH:XT60
U$30 U$31 = JH:SWITCH_SPDT
X1 = con-JST SH:BM10B-SRSS: JST SH series header 1.00mm pitch disconnectable crimp style connectors, vertical (side entry type), 10 pins